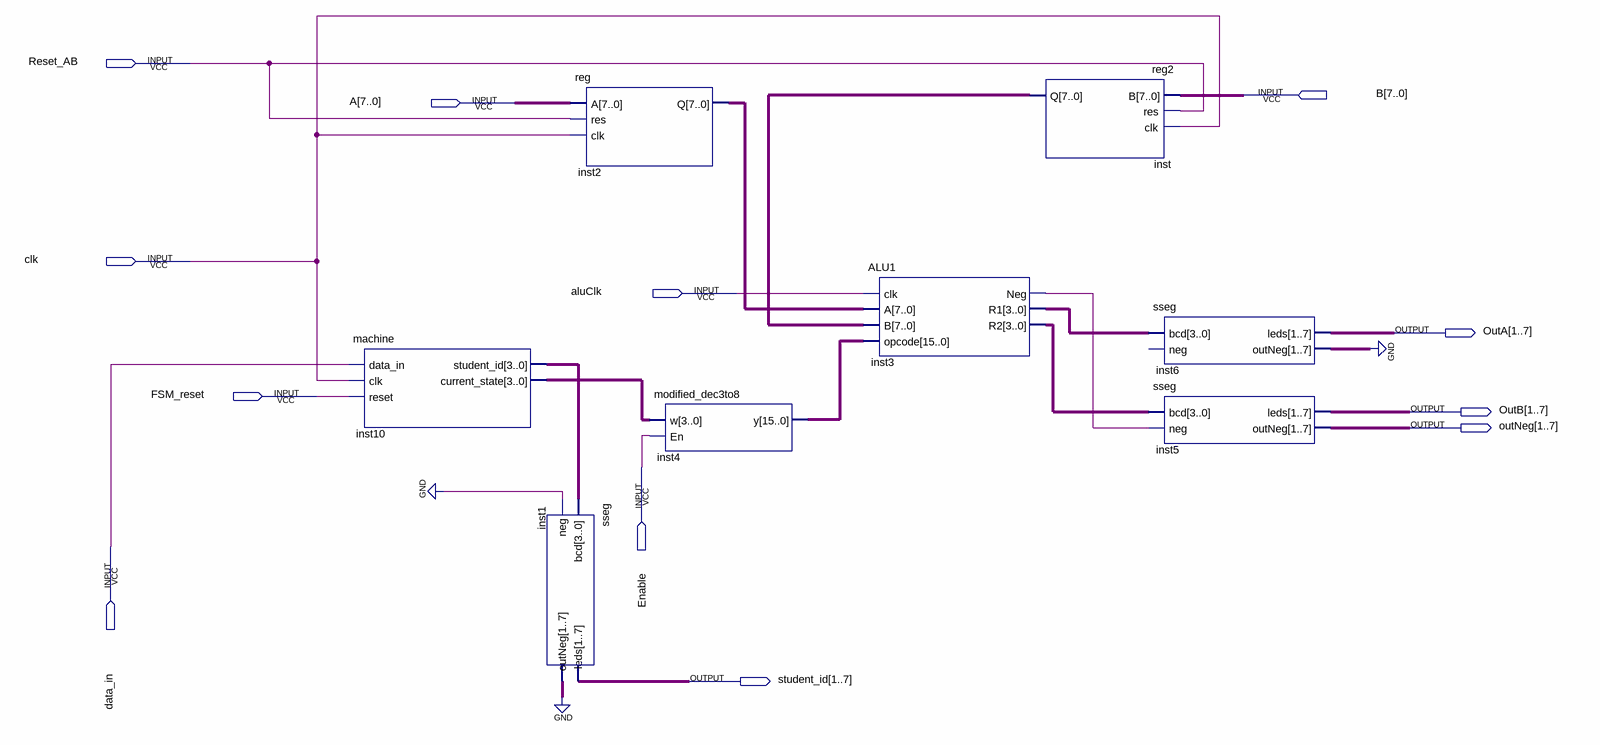
[diagram p0: schematic sheet]
// Quartus schematic ALU.bdf as structural Verilog: 8 symbols, 12 pins
module ALU (
  input  Reset_AB,
  input  [7:0] B,
  input  [7:0] A,
  input  clk,
  input  aluClk,
  input  FSM_reset,
  input  Enable,
  input  data_in,
  output [1:7] OutA,
  output [1:7] OutB,
  output [1:7] outNeg,
  output [1:7] student_id
);

  wire inst3_neg;
  wire [3:0] inst3_r1, inst3_r2, inst10_current_state, inst10_student_id;
  wire [6:0] inst1_outneg, inst6_outneg;
  wire [7:0] inst2_q, inst_q;
  wire [15:0] inst4_y;

  machine inst10 (
    .data_in(data_in), .clk(clk), .reset(FSM_reset), .student_id(inst10_student_id),
    .current_state(inst10_current_state));
  sseg inst1 (.bcd(inst10_student_id), .neg(1'b0), .leds(student_id), .outNeg(inst1_outneg));
  \reg  inst2 (.A(A), .res(Reset_AB), .clk(clk), .Q(inst2_q));
  modified_dec3to8 inst4 (.w(inst10_current_state), .En(Enable), .y(inst4_y));
  ALU1 inst3 (.clk(aluClk), .A(inst2_q), .B(inst_q), .opcode(inst4_y), .Neg(inst3_neg), .R1(inst3_r1), .R2(inst3_r2));
  reg2 inst (.B(B), .res(Reset_AB), .clk(clk), .Q(inst_q));
  sseg inst6 (.bcd(inst3_r1), .leds(OutA), .outNeg(inst6_outneg));  // open: neg
  sseg inst5 (.bcd(inst3_r2), .neg(inst3_neg), .leds(OutB), .outNeg(outNeg));
  // also tied to GND on the sheet: {inst1_outneg[0], inst1_outneg[1], inst1_outneg[2], inst1_outneg[3], inst1_outneg[4], inst1_outneg[5], inst1_outneg[6], inst6_outneg[0], inst6_outneg[1], inst6_outneg[2], inst6_outneg[3], inst6_outneg[4], inst6_outneg[5], inst6_outneg[6]}
endmodule
